# Altium schematic sheet 04_LCD.SchDoc
size A
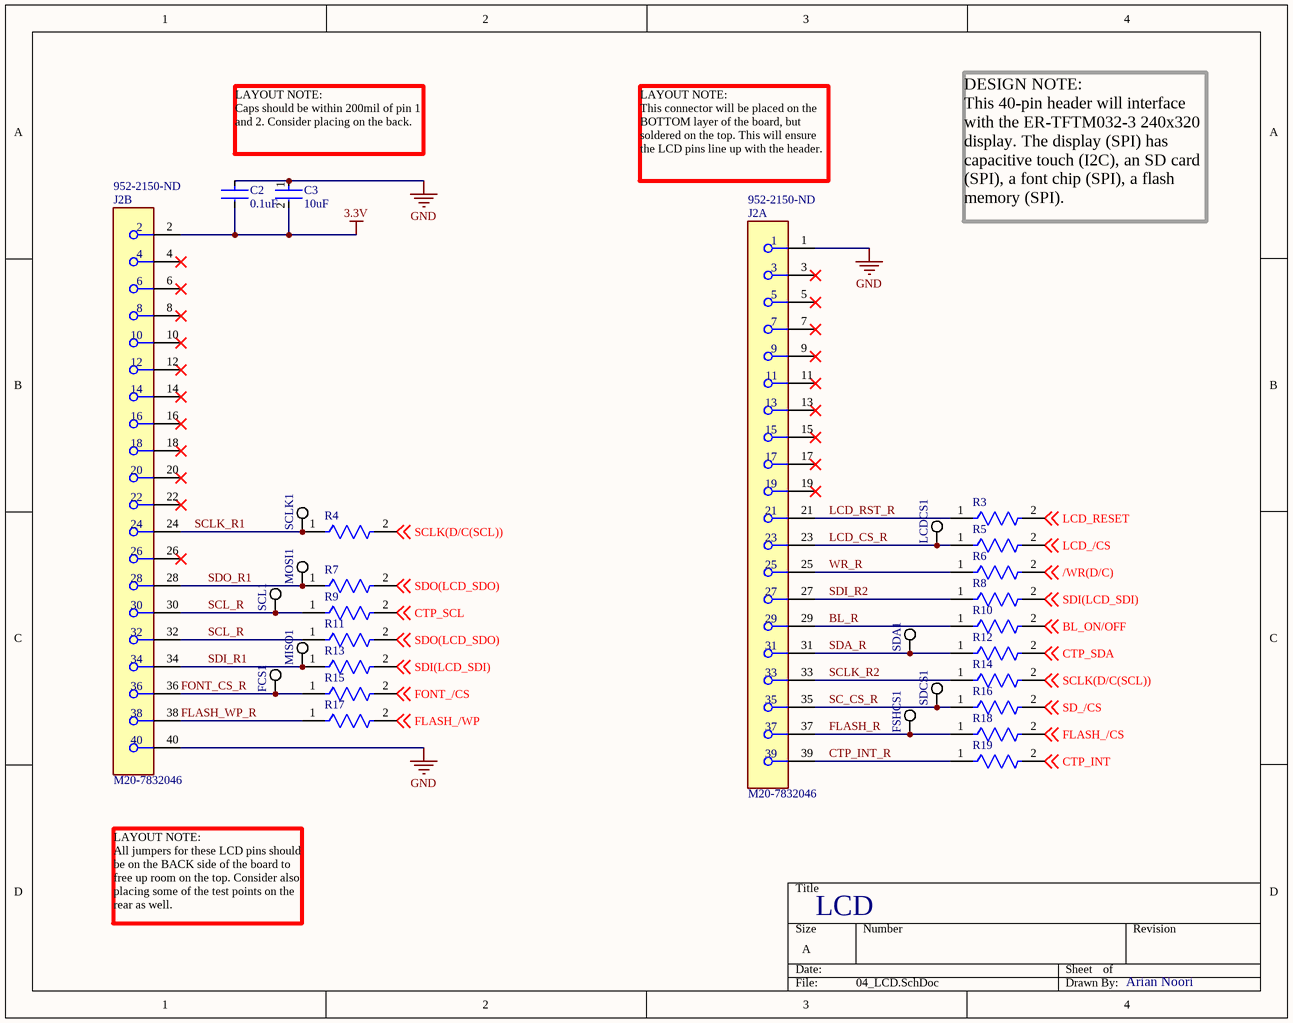
[diagram p0: 04_LCD.SchDoc]

## Parts
C2  0.1uF  [FP-CL21-IPC_C]
C3  value 10uF  [FP-C0805C-DG-MFG]  (hidden comment: C0805C106K8PACTU)
FCS1  5019  [KSTN-5019_V]  (value not drawn)
FSHCS1  5019  [KSTN-5019_V]  (value not drawn)
J2  M20-7832046  Supplier Part Number 1: 952-2150-ND  [FP-M20-7832046-MFG]  (parts A,B of 2)
LCDCS1  5019  [KSTN-5019_V]  (value not drawn)
MISO1  5019  [KSTN-5019_V]  (value not drawn)
MOSI1  5019  [KSTN-5019_V]  (value not drawn)
R3  (no value)  [FP-RC0805-MFG]
R4  (no value)  [FP-RC0805-MFG]
R5  (no value)  [FP-RC0805-MFG]
R6  (no value)  [FP-RC0805-MFG]
R7  (no value)  [FP-RC0805-MFG]
R8  (no value)  [FP-RC0805-MFG]
R9  (no value)  [FP-RC0805-MFG]
R10  (no value)  [FP-RC0805-MFG]
R11  (no value)  [FP-RC0805-MFG]
R12  (no value)  [FP-RC0805-MFG]
R13  (no value)  [FP-RC0805-MFG]
R14  (no value)  [FP-RC0805-MFG]
R15  (no value)  [FP-RC0805-MFG]
R16  (no value)  [FP-RC0805-MFG]
R17  (no value)  [FP-RC0805-MFG]
R18  (no value)  [FP-RC0805-MFG]
R19  (no value)  [FP-RC0805-MFG]
SCL1  5019  [KSTN-5019_V]  (value not drawn)
SCLK1  5019  [KSTN-5019_V]  (value not drawn)
SDA1  5019  [KSTN-5019_V]  (value not drawn)
SDCS1  5019  [KSTN-5019_V]  (value not drawn)

## Nets
3.3V: C2.2 C3.2 J2.2
GND: C2.1 C3.1 J2.1 J2.40
/WR(D/C): R6.2 ; off-sheet /WR(D/C)
BL_ON/OFF: R10.2 ; off-sheet BL_ON/OFF
BL_R: J2.29 R10.1
CTP_INT: R19.2 ; off-sheet CTP_INT
CTP_INT_R: J2.39 R19.1
CTP_SCL: R9.2 ; off-sheet CTP_SCL
CTP_SDA: R12.2 ; off-sheet CTP_SDA
FLASH_/CS: R18.2 ; off-sheet FLASH_/CS
FLASH_/WP: R17.2 ; off-sheet FLASH_/WP
FLASH_R: FSHCS1.1 J2.37 R18.1
FLASH_WP_R: J2.38 R17.1
FONT_/CS: R15.2 ; off-sheet FONT_/CS
FONT_CS_R: FCS1.1 J2.36 R15.1
LCD_/CS: R5.2 ; off-sheet LCD_/CS
LCD_CS_R: J2.23 LCDCS1.1 R5.1
LCD_RESET: R3.2 ; off-sheet LCD_RESET
LCD_RST_R: J2.21 R3.1
SC_CS_R: J2.35 R16.1 SDCS1.1
SCL_R: J2.30 J2.32 R9.1 R11.1 SCL1.1
SCLK(D/C(SCL)): R4.2 R14.2 ; off-sheet SCLK(D/C(SCL))
SCLK_R1: J2.24 R4.1 SCLK1.1
SCLK_R2: J2.33 R14.1
SD_/CS: R16.2 ; off-sheet SD_/CS
SDA_R: J2.31 R12.1 SDA1.1
SDI(LCD_SDI): R8.2 R13.2 ; off-sheet SDI(LCD_SDI)
SDI_R1: J2.34 MISO1.1 R13.1
SDI_R2: J2.27 R8.1
SDO(LCD_SDO): R7.2 R11.2 ; off-sheet SDO(LCD_SDO)
SDO_R1: J2.28 MOSI1.1 R7.1
WR_R: J2.25 R6.1

Not connected (* = marked no-connect by the designer): J2 3* 4* 5* 6* 7* 8* 9* 10* 11* 12* 13* 14* 15* 16* 17* 18* 19* 20* 22* 26*

## Notes on the sheet
- LAYOUT NOTE:
  Caps should be within 200mil of pin 1 and 2. Consider placing on the back.
- LAYOUT NOTE:
  This connector will be placed on the BOTTOM layer of the board, but soldered on the top. This will ensure the LCD pins line up with the header.
- DESIGN NOTE:
  This 40-pin header will interface with the ER-TFTM032-3 240x320 display. The display (SPI) has capacitive touch (I2C), an SD card (SPI), a font chip (SPI), a flash memory (SPI).
- LAYOUT NOTE:
  All jumpers for these LCD pins should be on the BACK side of the board to free up room on the top. Consider also placing some of the test points on the rear as well.
- LCD
- Arian Noori

## Library data of the parts
C2 = CMP-2000-05017-2: CL21 Series 0805 100nF 50V ±10% Tolerance X7R Multilayer Ceramic Chip Capacitor; Manufacturer: Samsung; Manufacturer Part Number: CL21B104KBCNNNC; Depth: 1.25mm; Height: 0.85mm; Width: 0.049inch; Tolerance: 10%; Case Code (Metric): 2012; Case Code (Imperial): 0805; Material: Ceramic; Thickness: 0.037inch; Min Operating Temperature: -55°C; Contact Plating: Tin; Length: 2mm; Mount: Surface Mount; Voltage Rating (DC): 50V; Lead Free: Lead Free; Dielectric: X7R; Radiation Hardening: No; Capacitance: 100nF; Voltage Rating: 50V; Case/Package: 0805; Packaging: Tape and Reel; Max Operating Temperature: 125°C; Voltage: 50V; Supplier 1: Digi-Key; RoHS: Yes; Category: Ceramic Capacitors; Stock 1: 4599648; Pricing 1: 1=0.10000, 10=0.04400, 50=0.02400, 100=0.01960, 500=0.01404, 1000=0.01103 (USD); Series: CL; Construction: Flat; RoHS Compliant: Yes; ComponentLink1URL: https://datasheet.ciiva.com/25710/cl21b104kbcnnnc-25710182.pdf?src-supplier=Digi-Key; ComponentLink1Description: https://datasheet.ciiva.com/25710/cl21b104kbcnnnc-25710182.pdf?src-supplier=Digi-Key; ComponentLink2URL: https://datasheet.ciiva.com/29199/454152-da-01-en-vs-kondensator-0805-29199814.pdf?src-supplier=Conrad; ComponentLink2Description: https://datasheet.ciiva.com/29199/454152-da-01-en-vs-kondensator-0805-29199814.pdf?src-supplier=Conrad
C3 = CMP-2007-03243-2: CAP CER 10UF 10V X5R 0805; Manufacturer: Kemet; 3DS Part Number: 220-00001; Tolerance: 10%; Temperature Coefficient: 15%; Material: Ceramic; Device Class L2: Capacitors; Device Class L1: Passive Components; ComponentLink2URL: https://content.kemet.com/datasheets/KEM_C1006_X5R_SMD.pdf; Height: 1.4mm; Lead Free: Yes; Manufacturer Part Number: C0805C106K8PACTU; Digikey Description: CAP CER 10UF 10V X5R 0805; Octopart: https://octopart.com/c0805c106k8pactu-kemet-98697; Capacitance: 10uF; Temperature Range Low: -55°C; Temperature: -55°C to +85°C; Automotive: No; Mouser Description: CAP CER 10UF 10V X5R 0805; Ipc Land Pattern Name: CAPC200125X125; Temperature Range High: +85°C; Voltage: 10V; RoHS: TRUE; Device Class L3: Ceramic Capacitors; ComponentLink2Description: Datasheet; Voltage Rating: 10V; Package: C0805C-DG; Temperature Characteristic: X5R; Category: Cap; Supplier 1: Digi-Key; Supplier Part Number 1: 399-C0805C106K8PAC7800CT-ND; Manufacturer 1: KEMET; Manufacturer Part Number 1: C0805C106K8PACTU; Stock 1: 8631846; Pricing 1: 1=0.14000, 10=0.10300, 50=0.05840, 100=0.04830, 500=0.03388, 1000=0.02805 (USD); Mount: Surface Mount; Case/Package: 0805; Number of Pins: 2; Case Code (Imperial): 0805; Case Code (Metric): 2012; Dielectric Material: Ceramic; Contact Plating: Tin,Matte; Min Operating Temperature: -55°C; Max Operating Temperature: 85°C; Packaging: Tape and Reel; Dielectric: X5R; Package Quantity: 1; Voltage Rating (DC): 10V; Series: C; Termination: SMD/SMT; Construction: Flat; Dissipation Factor: 10%; Length: 2mm; Width: 1.2mm; Depth: 1.25mm; Thickness: 0.055inch; Radiation Hardening: No; REACH SVHC: No SVHC; RoHS Compliant: Yes
FCS1 FSHCS1 LCDCS1 MISO1 MOSI1 SCL1 SCLK1 SDA1 SDCS1 = CMP-1672-00008-1: Test Point, 1 Position SMD, RoHS, Tape and Reel; Manufacturer: Keystone Electronics; ComponentLink1Description: Manufacturer URL; Package Quantity: 1000; DatasheetVersion: 03/2014; Packaging: Tape and Reel; ComponentLink2URL: http://www.keyelco.com/product-pdf.cfm?p=1357; ComponentLink1URL: http://www.keyelco.com/; Mount: Surface Mount; Contact Plating: Silver; PackageDescription: 1-Pin Surface Mount Device, Body 3.81 x 2.03 mm; Pins: 1; RoHSCompliant: True; Mounting Technology: Surface Mount; ComponentLink2Description: Datasheet; PackageReference: 5019; Supplier 1: Digi-Key; Manufacturer Part Number: 5019; RoHS: Yes; Category: Connectors; Stock 1: 1295398; Pricing 1: 1=0.34000, 25=0.27360, 100=0.22340, 250=0.20064, 500=0.19152 (USD); Number of Pins: 1; Material: Bronze; Contact Material: Bronze; Termination: SMD/SMT; Series: 5019; Height: 0.09inch; REACH SVHC: No SVHC; RoHS Compliant: Yes; Lead Free: Lead Free; ComponentLink3URL: https://datasheet.ciiva.com/16318/m60-2p61-16318395.pdf?src-supplier=Future+Electronics; ComponentLink3Description: https://datasheet.ciiva.com/16318/m60-2p61-16318395.pdf?src-supplier=Future+Electronics; ComponentLink4URL: https://datasheet.ciiva.com/16885/70182998-16885945.pdf?src-supplier=Allied+Electronics; ComponentLink4Description: https://datasheet.ciiva.com/16885/70182998-16885945.pdf?src-supplier=Allied+Electronics; ComponentLink5URL: https://datasheet.ciiva.com/14848/m60-2p61-14848437.pdf?src-supplier=Digi-Key; ComponentLink5Description: https://datasheet.ciiva.com/14848/m60-2p61-14848437.pdf?src-supplier=Digi-Key; ComponentLink6URL: https://datasheet.ciiva.com/14848/m60-2p61-14848438.pdf?src-supplier=Digi-Key; ComponentLink6Description: https://datasheet.ciiva.com/14848/m60-2p61-14848438.pdf?src-supplier=Digi-Key; ComponentLink7URL: https://datasheet.ciiva.com/14848/m60-2p61-14848439.pdf?src-supplier=Digi-Key; ComponentLink7Description: https://datasheet.ciiva.com/14848/m60-2p61-14848439.pdf?src-supplier=Digi-Key
J2 = CMP-15831-000036-1: CONN RCPT 40POS 0.1 TIN PCB; Manufacturer: Harwin; Connector Type: Receptacle; Contact Resistance: 20mR; Pitch: 2.54mm; Insulation Resistance: 1MR; Mating Cycles: 50; Number of Contacts: 40; Max Current Rating: 3A; Hole Diameter: 0.8mm; Row Spacing: 0.1inch; Contact Material: Bronze; RoHS Compliant: Yes; Min Operating Temperature: -40°C; Mount: Through Hole; Gender: Receptacle; Depth: 5.04mm; Package Quantity: 11; Series: M20; REACH SVHC: No SVHC; Color: Black; Lead Pitch: 2.54mm; Max Operating Temperature: 105°C; Orientation: Straight; Radiation Hardening: No; Contact Plating: Tin; Housing Material: Polyamide; Housing Color: Black; Length: 51.2mm; Contact Gender: Female; Number of Positions: 40; Packaging: Rail/Tube; Number of Rows: 2; Material: Glass; Contact Type: Female Socket; Current Rating: 3A; Termination: Solder; Supplier 1: Digi-Key; Manufacturer Part Number: M20-7832046; RoHS: Yes; Category: Headers and Wire Housings; Stock 1: 6647; Pricing 1: 1=3.77000, 11=3.42273, 88=3.01591, 440=2.56348, 946=2.18650, 4906=1.96031 (USD); ComponentLink1URL: https://datasheet.ciiva.com/11748/0900766b80dc1d2a-11748805.pdf?src-supplier=RSComponents; ComponentLink1Description: https://datasheet.ciiva.com/11748/0900766b80dc1d2a-11748805.pdf?src-supplier=RSComponents; ComponentLink2URL: https://datasheet.ciiva.com/26852/getdatasheetpartid-499542-26852174.pdf?src-supplier=Verical; ComponentLink2Description: https://datasheet.ciiva.com/26852/getdatasheetpartid-499542-26852174.pdf?src-supplier=Verical; ComponentLink3URL: https://datasheet.ciiva.com/9479/m20-783-9479864.pdf?src-supplier=Avnet; ComponentLink3Description: https://datasheet.ciiva.com/9479/m20-783-9479864.pdf?src-supplier=Avnet; ComponentLink4URL: https://datasheet.ciiva.com/6795/m20-783-6795342.pdf?src-supplier=Digi-Key; ComponentLink4Description: https://datasheet.ciiva.com/6795/m20-783-6795342.pdf?src-supplier=Digi-Key; ComponentLink5URL: https://datasheet.ciiva.com/7639/1836950-7639737.pdf?src-supplier=Element14; ComponentLink5Description: https://datasheet.ciiva.com/7639/1836950-7639737.pdf?src-supplier=Element14
R3-R19 = CMP-2001-04570-2: RES SMD 0 OHM JUMPER 1/8W 0805; Manufacturer: Yageo; Manufacturer Part Number: RC0805FR-070RL; Resistance: 0Ω; Value: 0Ω; Power Rating: 0.125W; Tolerance: 1%; Voltage Rating: 150V; Max Power Dissipation: 125mW; RoHS: TRUE; Device Class L2: Resistors; Composition: Thick Film; Device Class L1: Passive Components; Height: 0.6mm; Category: Res; Automotive: No; Device Class L3: Chip SMD Resistors; ComponentLink2URL: http://www.yageo.com/documents/recent/PYu-RC_Group_51_RoHS_L_10.pdf; Octopart: https://octopart.com/rc0805fr-070rl-yageo-9293404; Temperature Range High: +155°C; Ipc Land Pattern Name: RESC200125X50; Footprint Url: http://www.yageo.com/exep/pages/download/literatures/PYu-R_Mount_10.pdf; Series: RC_L; Digikey Description: RES SMD 0 OHM JUMPER 1/8W 0805; Temperature Range Low: -55°C; Temperature: -55°C to +155°C; Package: RC0805; ComponentLink2Description: Datasheet; Lead Free: Yes; Supplier 1: Digi-Key; Stock 1: 908367; Pricing 1: 1=0.10000, 10=0.03300, 25=0.02360, 50=0.01800, 100=0.01330, 250=0.01012, 500=0.00810, 1000=0.00597 (USD); Case/Package: 0805; Case Code (Imperial): 0805; Case Code (Metric): 2012; Contact Plating: Tin,Matte; Size Code: 0805; Min Operating Temperature: -55°C; Max Operating Temperature: 155°C; Packaging: Tape and Reel; Resistor Type: Thick Film; Number of Terminations: 2; Construction: Rectangular; Features: Moisture Resistant; Length: 2mm; Depth: 1.25mm; Radiation Hardening: No; RoHS Compliant: Yes; Military Standard: Not; ComponentLink1URL: https://datasheet.ciiva.com/15189/getdatasheetpartid-348154-15189885.pdf?src-supplier=Verical; ComponentLink1Description: https://datasheet.ciiva.com/15189/getdatasheetpartid-348154-15189885.pdf?src-supplier=Verical; ComponentLink3URL: https://datasheet.ciiva.com/17042/rc0805-17042698.pdf?src-supplier=Future+Electronics; ComponentLink3Description: https://datasheet.ciiva.com/17042/rc0805-17042698.pdf?src-supplier=Future+Electronics